# EAGLE design IO4-QuadOD (EAGLE 7.7.0)
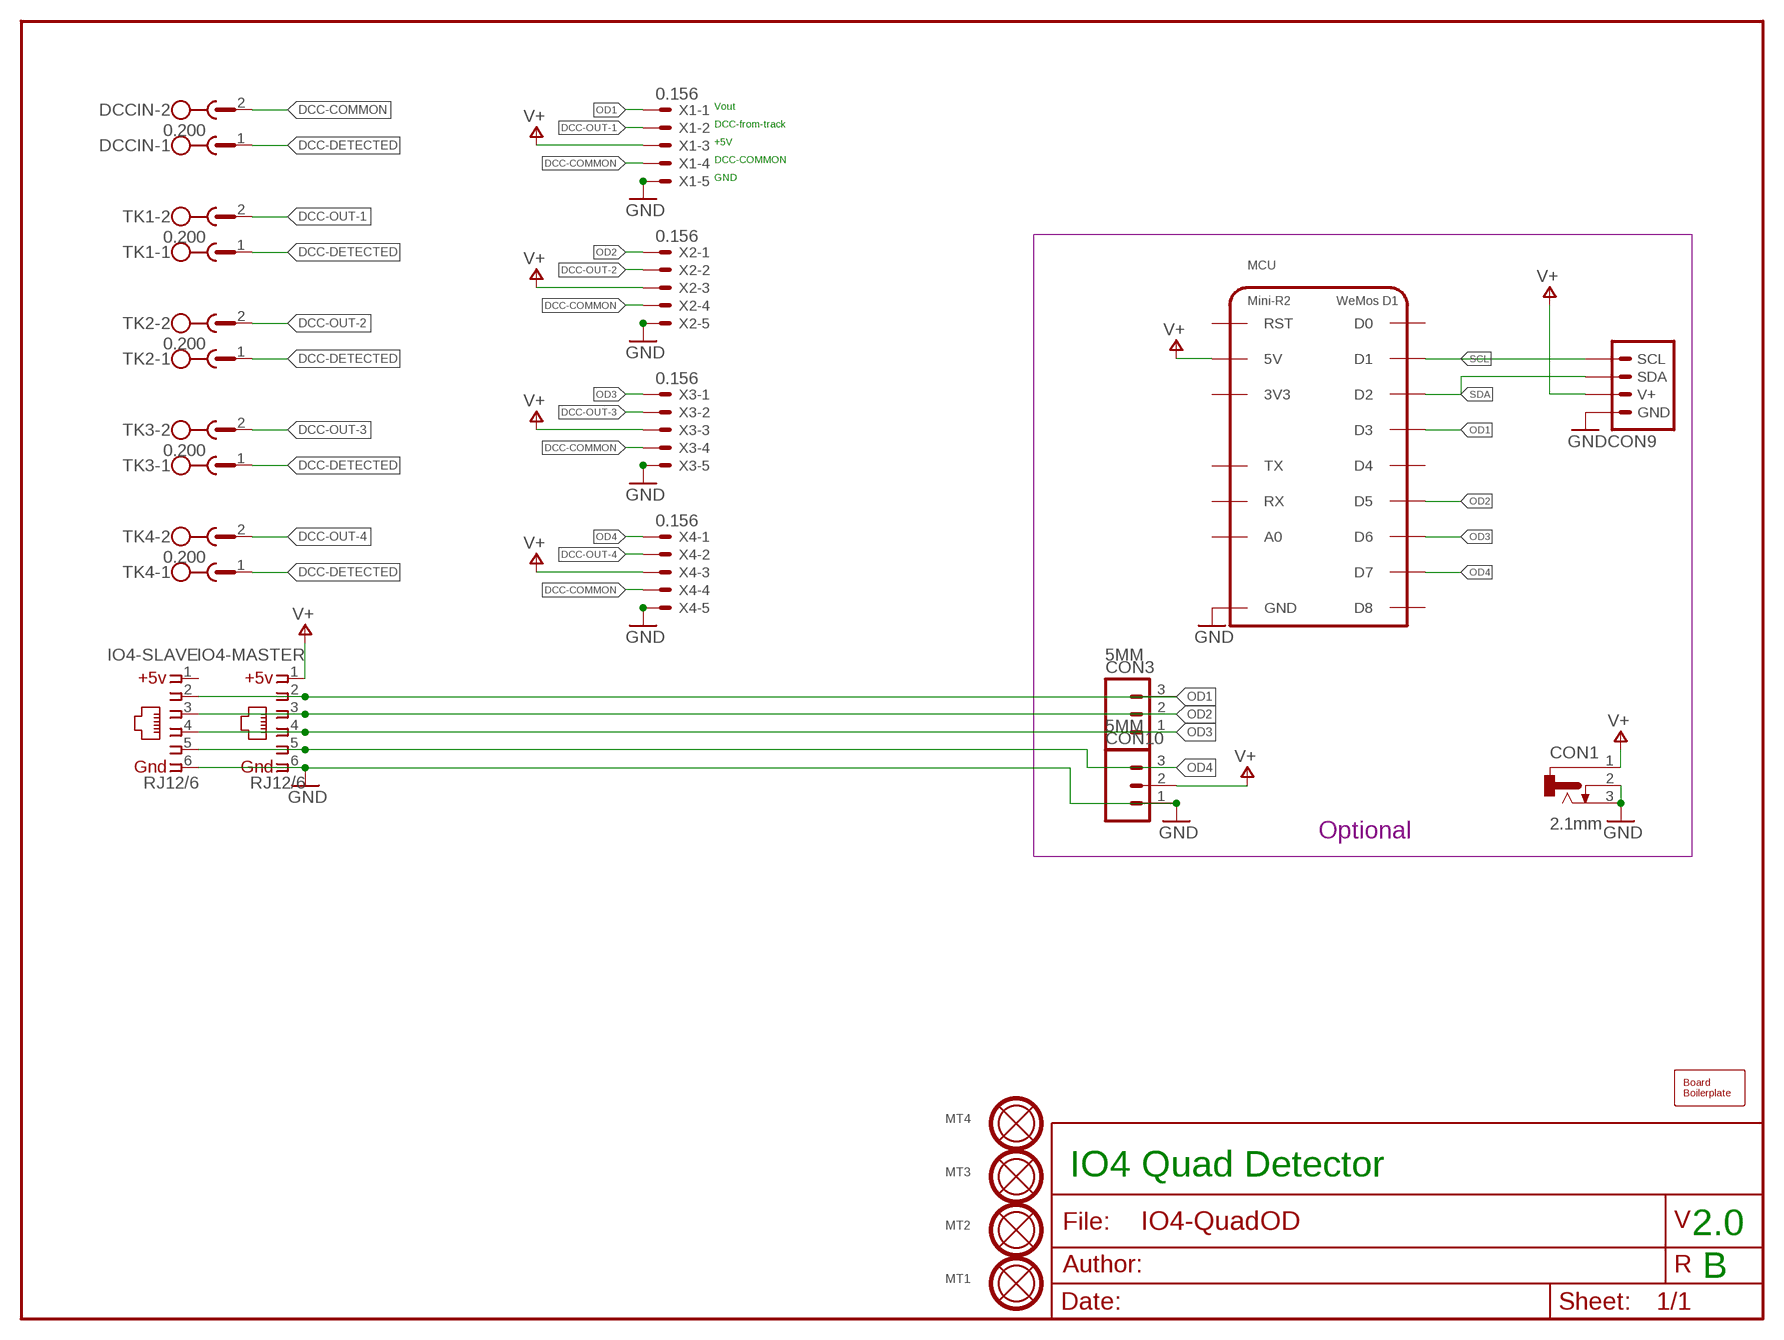
[diagram p0: schematic, sheet 1]

## Parts
BOARD1  BOARD  BOARD100X100-NOHOLES  [BOARD-SEEED10X10-NOHOLES]
CON1  2.1mm  CONNECTOR-DC-POWER-RA  [DCJ0202]
CON3  5MM  CONNECTOR-M035MM-LOCK  [SCREWTERMINAL-5MM-3]
CON9  CONNECTOR-I2CLEFT  [I2C-L]
CON10  5MM  CONNECTOR-M035MM-LOCK  [SCREWTERMINAL-5MM-3]
DCCIN  0.200  CONNECTOR-MSTBA2-ORIG  [MSTBA2]
IO4-MASTER  RJ12/6  CONNECTOR-IO4INV  [RJ25-INVERTED]
IO4-SLAVE  RJ12/6  CONNECTOR-IO4INV  [RJ25-INVERTED]
MCU  Mini-R2  WEMOS-D1V1  [WEMOS-D1]
MT1  MOUNTINGHOLE  [MOUNTINGHOLE]
MT2  MOUNTINGHOLE  [MOUNTINGHOLE]
MT3  MOUNTINGHOLE  [MOUNTINGHOLE]
MT4  MOUNTINGHOLE  [MOUNTINGHOLE]
TK1  0.200  CONNECTOR-MSTBA2-ORIG  [MSTBA2]
TK2  0.200  CONNECTOR-MSTBA2-ORIG  [MSTBA2]
TK3  0.200  CONNECTOR-MSTBA2-ORIG  [MSTBA2]
TK4  0.200  CONNECTOR-MSTBA2-ORIG  [MSTBA2]
X1  0.156  KK-156-5  [KK-156-5]
X2  0.156  KK-156-5  [KK-156-5]
X3  0.156  KK-156-5  [KK-156-5]
X4  0.156  KK-156-5  [KK-156-5]

## Nets
DCC-COMMON: DCCIN.2 X1.4 X2.4 X3.4 X4.4
DCC-DETECTED: DCCIN.1 TK1.1 TK2.1 TK3.1 TK4.1
DCC-OUT-1: TK1.2 X1.2
DCC-OUT-2: TK2.2 X2.2
DCC-OUT-3: TK3.2 X3.2
DCC-OUT-4: TK4.2 X4.2
GND: CON1.2 CON1.3 CON9.GND CON9.GND@1(GND) CON10.1 IO4-MASTER.6 IO4-SLAVE.6 MCU.GND X1.5 X2.5 X3.5 X4.5
OD1: CON3.3 IO4-MASTER.2 IO4-SLAVE.2 MCU.D3 X1.1
OD2: CON3.2 IO4-MASTER.3 IO4-SLAVE.3 MCU.D5 X2.1
OD3: CON3.1 IO4-MASTER.4 IO4-SLAVE.4 MCU.D6 X3.1
OD4: CON10.3 IO4-MASTER.5 IO4-SLAVE.5 MCU.D7 X4.1
SCL: CON9.SCL CON9.SCL@1(SCL) MCU.D1
SDA: CON9.SDA CON9.SDA@1(SDA) MCU.D2
V+: CON1.1 CON9.V+ CON9.V+@1(V+) CON10.2 IO4-MASTER.1 MCU.5V X1.3 X2.3 X3.3 X4.3
Unconnected: MCU.3V3 MCU.A0 MCU.D0 MCU.D4 MCU.D8 MCU.RST MCU.RX MCU.TX

## Notes on the sheet
- Vout
- DCC-from-track
- +5V
- DCC-COMMON
- GND
- Optional
- IO4 Quad Detector
- 2.0
- B

## Power pins joined to a net without a drawn wire
1: IO4-SLAVE.1

## Library data of the parts
BOARD1 = SPCoast:BOARD
CON1 = SPCoast:CONNECTOR-DC-POWER: DC POWER JACK
CON3 CON10 = SPCoast:CONNECTOR-M03
CON9 = SPCoast:CONNECTOR-I2C
DCCIN TK1-TK4 = SPCoast:CONNECTOR-MSTBA2-ORIG: PHOENIX; MF: FARNELL; MPN: 1757242; OC_FARNELL: 3705171; OC_NEWARK: 71C4161
IO4-MASTER IO4-SLAVE = SPCoast:CONNECTOR-IO4
MCU = SPCoast:WEMOS-D1
MT1-MT4 = SPCoast:MOUNTINGHOLE: Mounting hole with top and bottom copper and stop rings
X1-X4 = SPCoast:KK-156-5: KK 156 HEADER Source: http://www.molex.com/pdm_docs/sd/026604100_sd.pdf; OC_FARNELL: unknown; OC_NEWARK: unknown

## Board
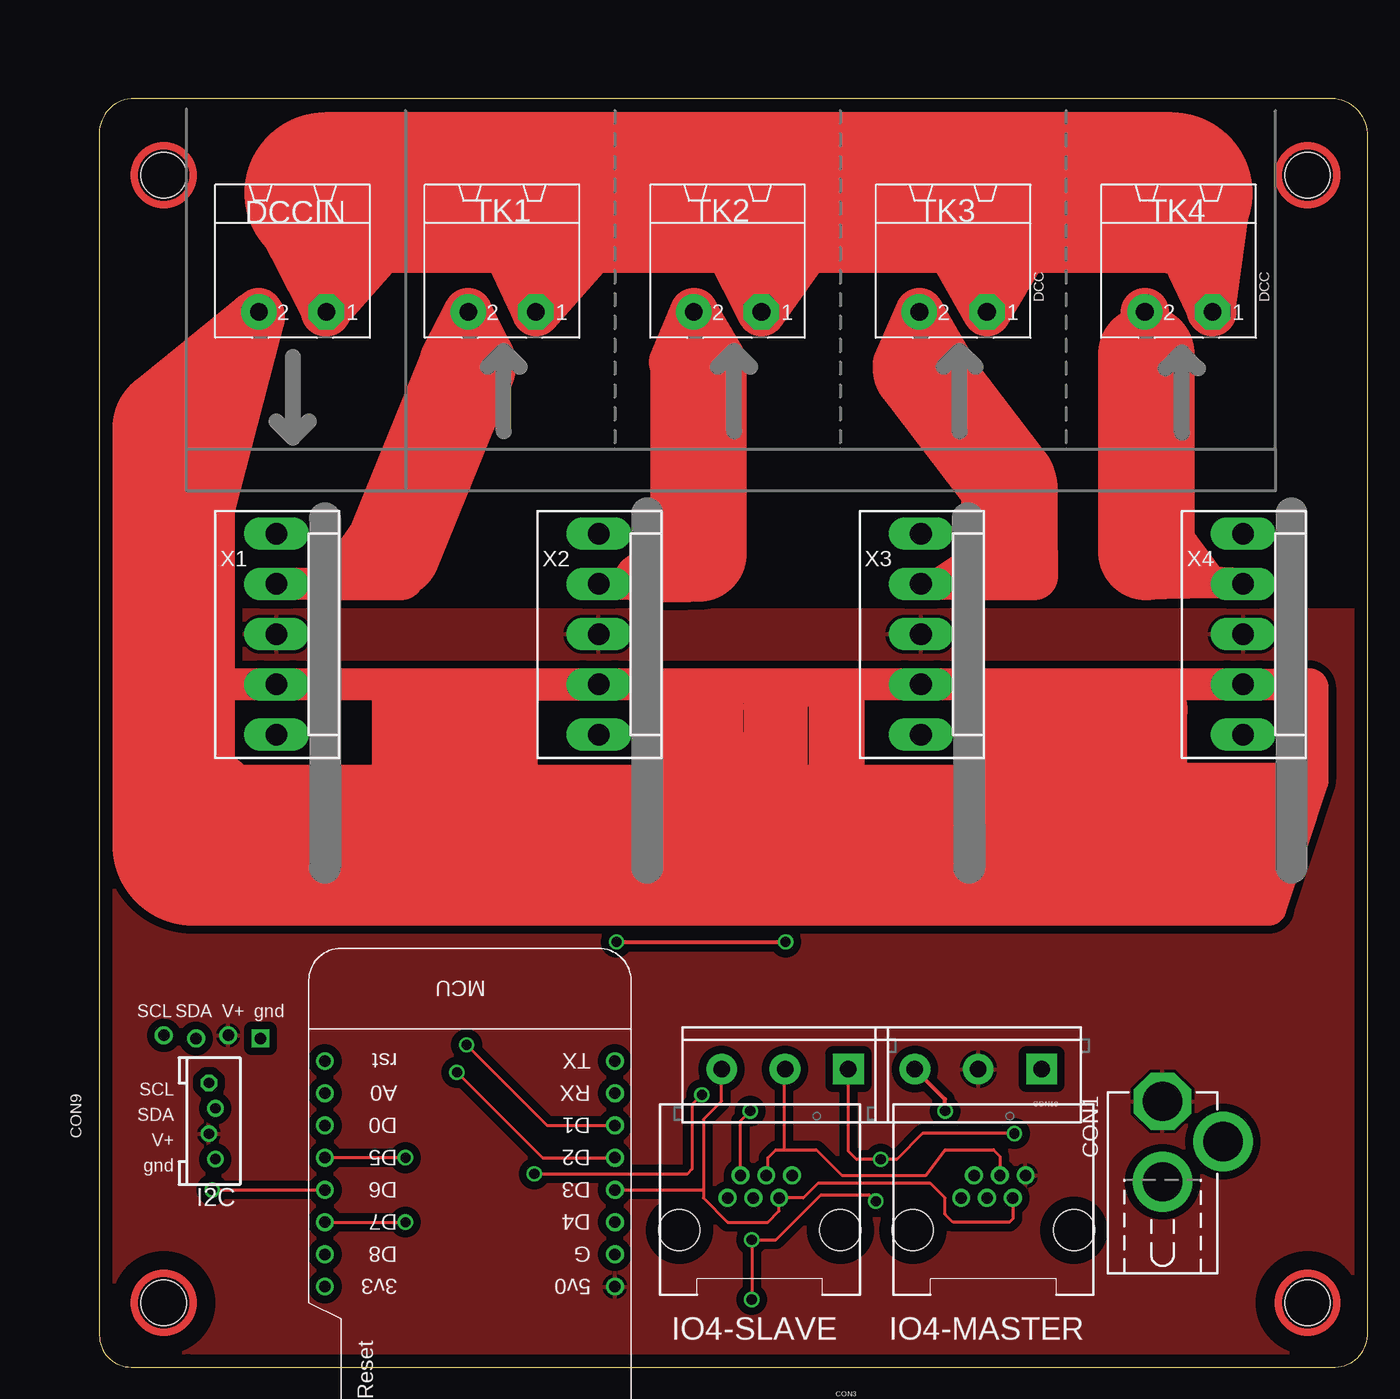
[diagram p1: board, top side]
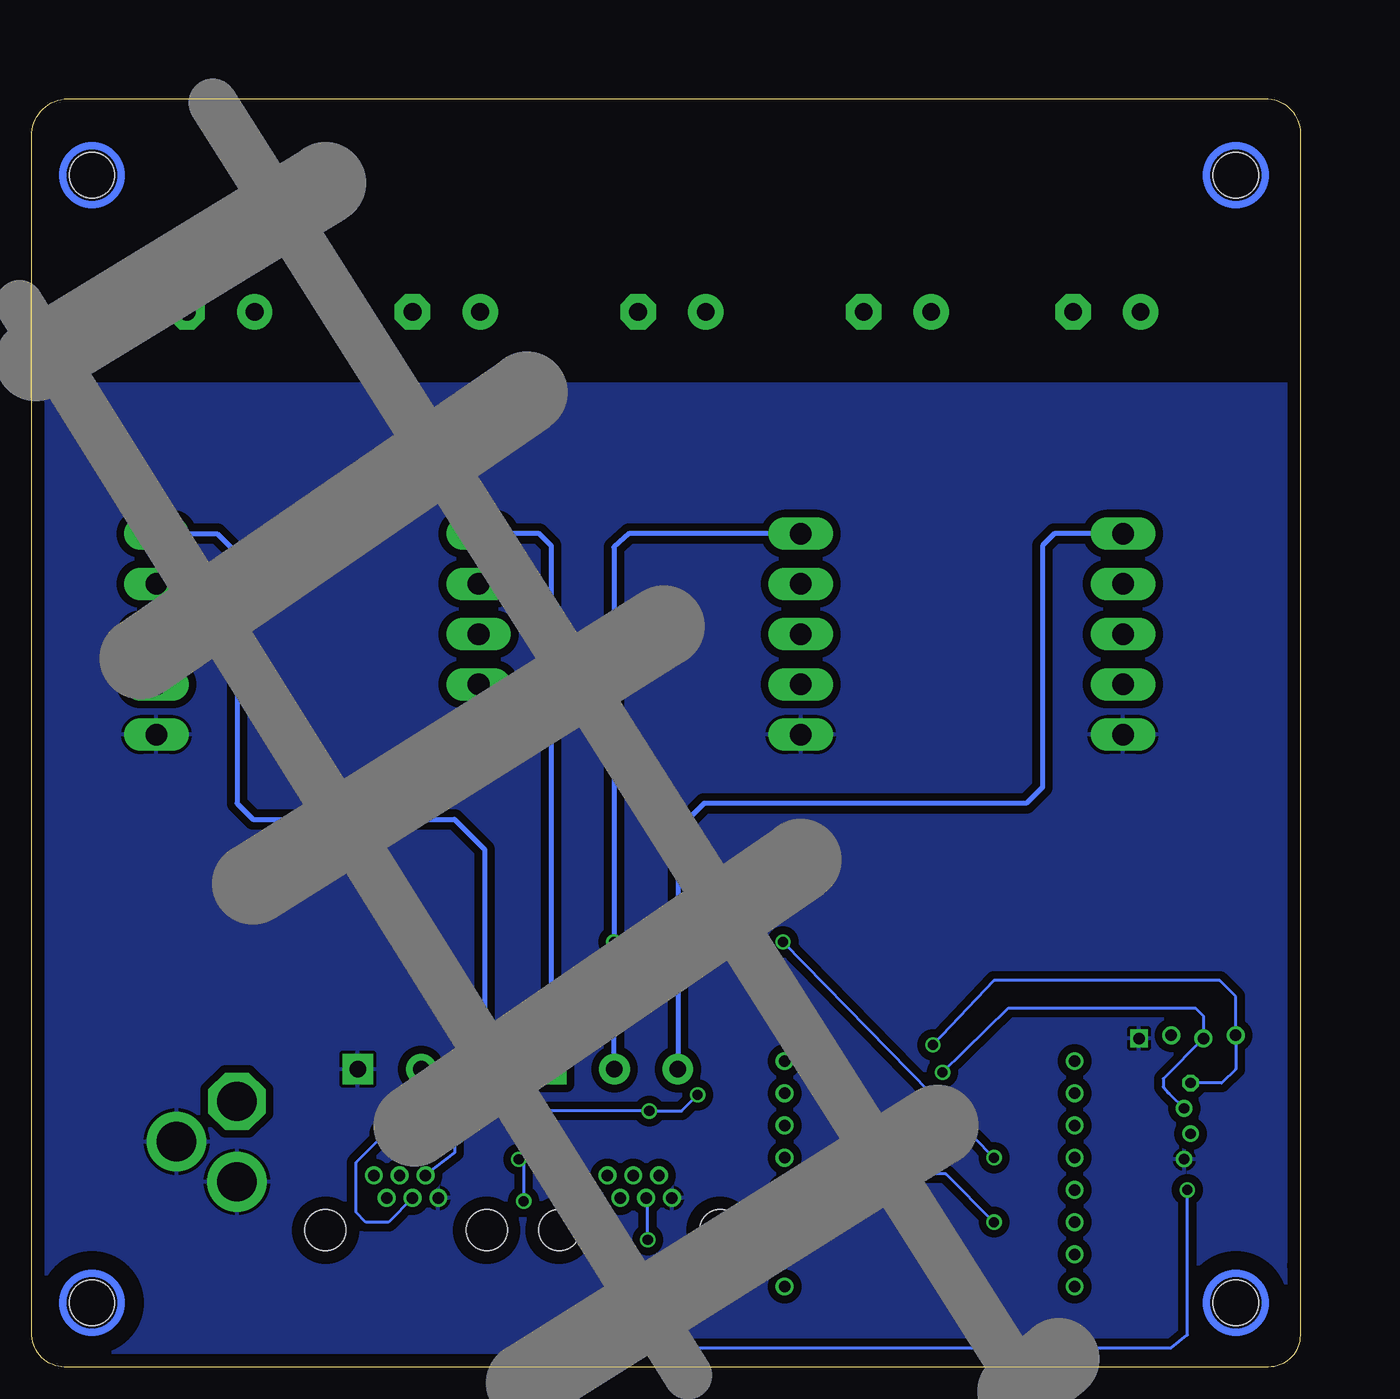
[diagram p2: board, bottom side, seen from below]

Size 100.01 x 100 mm. Coordinates in mm from the lower left corner, seen from the top.
Copper layers (1*16): Top 0.035mm / dielectric 1.5mm / Bottom 0.035mm
Design rules "default": minimum track width 10mil, minimum drill 24mil, track to track 8mil, track to pad 8mil, pad to pad 8mil, via to via 8mil, smd to smd 8mil, copper to edge 40mil, drill to drill 8mil, minimum pad ring 10mil, minimum via ring 8mil, stop-mask expansion 4mil, vias tented up to drill 0mil, thermal gap 10mil

### Footprints (pad centres in the part's own frame; a part is rotated, then mirrored left to right if it is on the bottom)
DCJ0202 = drill 3.1 pad 4.5 octagon: 1 0,3.175 | drill 3.1 pad 4.7: 2 4.763,0; 3 0,-3.175
SCREWTERMINAL-5MM-3 = drill 1.3 pad 2.413 square: 1 0,0 | drill 1.3 pad 2.413: 2 5,0; 3 10,0
I2C-L = drill 0.9 square: GND 3.81,-0.127 | drill 0.8 pad 1.27: GND@1 0.254,-9.635; SDA@1 0.254,-5.635; V+@1 -0.254,-7.635 | drill 0.9: SCL -3.81,0.127; SDA -1.27,-0.127; V+ 1.27,0.127 | drill 0.8 pad 1.27 octagon: SCL@1 -0.254,-3.635
MSTBA2 = drill 1.397 pad 2.794 octagon: 1 -2.667,5.08 | drill 1.397 pad 2.794: 2 2.667,5.08
RJ25-INVERTED = drill 0.9 pad 1.4: 1 2.54,4.318; 2 1.524,2.54; 3 0.508,4.318; 4 -0.508,2.54; 5 -1.524,4.318; 6 -2.54,2.54 | hole 3.251: -6.35,0; 6.35,0
WEMOS-D1 = drill 0.9: 3V3 -11.43,-7.62; 5V 11.43,-7.62; A0 -11.43,7.62; D0 -11.43,5.08; D1 11.43,5.08; D2 11.43,2.54; D3 11.43,0; D4 11.43,-2.54; D5 -11.43,2.54; D6 -11.43,0; D7 -11.43,-2.54; D8 -11.43,-5.08; GND 11.43,-5.08; RST -11.43,10.16; RX 11.43,7.62; TX 11.43,10.16
MOUNTINGHOLE = hole 3.6: 0,0
KK-156-5 = drill 1.7 pad 2.184 long: 1 -7.92,0; 2 -3.96,0; 3 0,0; 4 3.96,0; 5 7.92,0

### Placement (x,y rotation side)
BOARD1  0.01,0 0 top
CON1  83.83,17.78 0 top
CON3  59.06,23.5 180 top
CON9  8.9,26.04 0 top
CON10  74.3,23.5 180 top
DCCIN  15.25,88.27 180 top
IO4-MASTER  70.49,10.8 0 top
IO4-SLAVE  52.08,10.8 0 top
MCU  29.22,13.97 0 top
MT1  5.09,5.08 0 top
MT2  95.26,5.08 0 top
MT3  95.26,93.98 0 top
MT4  5.09,93.98 0 top
TK1  31.76,88.27 180 top
TK2  49.54,88.27 180 top
TK3  67.32,88.27 180 top
TK4  85.1,88.27 180 top
X1  13.98,57.79 270 top
X2  39.38,57.79 270 top
X3  64.78,57.79 270 top
X4  90.18,57.79 270 top

### Tracks (layer width: path | path; a pad name or v marks a point on that pad's centre or on a via)
DCC-COMMON
  Top 10.16: 7.5,43.31 6.74,42.68
  Top 11.43: 7.38,41.15 7.5,43.31
  Top 12.7: 81.29,41.15 7.38,41.15
  Top 2.54: 6.08,54.34 6.74,42.68 | 59.06,53.47 59.06,43.82 57.29,43.82 | 57.29,43.82 52.08,43.82 52.08,46.99 | 52.08,46.99 52.08,53.6 44.33,53.6 44.33,46.36 54.62,46.36 54.62,53.34 57.16,53.34 57.16,46.36 | 28.33,53.34 30.87,53.34 30.87,45.6 33.28,45.6 33.28,53.83 X2.4 | 28.33,45.98 25.28,45.98 | 25.28,52.96 22.74,53.72 22.74,43.69 | 95.39,53.57 95.39,53.85 93.99,53.85 X4.4 X3.4 X2.4 | 95.39,46.36 85.1,46.36 85.1,44.45 | 85.1,44.45 94.75,44.58 94.24,42.29 85.73,42.55 85.73,40.64 93.35,40.64 92.97,38.74 82.56,38.74 81.29,36.2 | X2.4 X1.4 9.38,53.83 8.9,53.34 | 57.29,43.69 57.29,43.82 | 82.56,43.31 83.32,44.45 85.1,44.45 | 72.4,49.53 69.86,52.07 | 69.86,52.07 69.86,53.34 | 69.86,52.07 69.86,46.99 | 52.08,46.99 49.54,49.53 49.54,52.07 47,52.07 arc60 49.54,46.99 47,46.99 45.73,48.26 45.73,52.07
  Top 2.794: 81.29,36.2 92.21,36.2 95.51,46.23
  Top 3.048: 28.33,53.34 28.33,45.98 | 25.28,45.98 25.28,52.96 | 95.39,53.57 95.39,46.36
  Top 3.81: DCCIN.2 12.07,82.68 9.28,76.71 12.07,82.81 4.07,76.33 8.77,67.57 12.71,82.68 12.71,82.93 6.74,73.66
  Top 6.452: 81.29,41.15 82.56,43.31 82.56,51.82 78.37,51.69 78.11,51.69 78.11,46.28 78.11,43.31 78.37,43.69 57.29,43.69
  Top 7.62: 78.11,46.28 74.86,49.53 72.4,49.53
  Top 9.652: 6.74,42.68 5.85,41.15 5.85,74.04 6.74,74.04 6.74,73.66
DCC-DETECTED
  Top 12.7: 84.59,92.59 73.67,92.59 53.98,92.59 35.57,92.59 17.79,92.59
  Top 3.81: DCCIN.1 13.98,90.81 22.87,88.9 17.79,83.19 17.79,92.59 17.92,93.98 | 84.59,92.59 88.91,92.46 87.64,83.32 TK4.1 85.35,88.27 | 73.67,92.59 69.99,92.84 73.16,88.52 TK3.1 66.18,89.92 | 53.98,92.59 52.21,92.84 56.02,88.52 TK2.1 48.14,91.19 | 35.57,92.59 34.43,92.84 38.62,87.89 TK1.1 29.85,92.97
DCC-OUT-1
  Top 2.54: X1.2 20.2,61.73 18.55,62.36 20.96,65.79
  Top 3.81: 23.12,64.39 23.76,62.36 18.55,62.36 | 29.09,79 27.19,79.51 TK1.2 30.87,79.63
  Top 7.62: 23.12,64.39 29.09,79
DCC-OUT-2
  Top 2.54: 42.55,62.23 42.4,61.75 X2.2 | 44.46,63.5 44.52,63.44 46.43,63.44
  Top 3.81: 44.46,63.5 44.59,62.23 | 47.25,64.14 46.43,63.44 46.36,63.38 46.36,62.23 43.19,62.23 | 44.46,63.5 42.55,62.23 43.19,62.23 | 44.46,63.5 45.09,64.14 45.73,64.14 43.19,62.23 | 47.25,78.36 45.22,79.25 | 45.22,79.25 TK2.2 49.29,79.12 45.22,79.25
  Top 7.62: 47.25,64.14 47.25,78.36
DCC-OUT-3
  Top 2.54: 68.59,62.36 68.82,61.75 66.23,61.75 | 66.23,61.75 X3.2 | 66.23,61.75 69.99,64.27
  Top 3.81: 71.64,69.73 71.76,69.35 | 71.76,64.39 73.67,64.14 73.67,62.36 68.59,62.36 | 64.78,78.74 62.87,79.12 TK3.2 67.32,78.62
  Top 7.62: 71.76,69.35 71.76,64.39 | 71.64,69.73 64.78,78.74
DCC-OUT-4
  Top 2.54: X4.2 87.69,61.86 | 87.69,61.86 82.31,61.75 82.18,63.25 82.56,64.27 | 87.69,61.86 84.21,66.55
  Top 3.81: TK4.2 82.56,79.89
  Top 7.62: 82.56,79.89 82.56,64.27
GND
  pour Bottom (isolate 0.61): 100.34,77.47 100.34,0 0.01,0 0.01,77.47
OD1
  Top 0.254: IO4-MASTER.2 72.02,11.69 71.76,11.43 67.32,11.43 66.68,12.07 66.68,13.34 65.54,14.48 56.65,14.48 55.51,13.34 IO4-SLAVE.2 53.6,12.32 52.71,11.43 49.54,11.43 47.63,13.34 47.63,13.97 | 47.63,13.97 47.63,19.53 49.06,20.96 CON3.3 | MCU.D3 47.63,13.97
  Bottom 0.406: X1.1 19.39,65.71 20.33,64.77 20.33,45.72 21.6,44.45 47,44.45 49.06,42.39 CON3.3
OD2  (via drill 0.8)
  Top 0.254: IO4-SLAVE.3 52.71,15.24 52.71,16.51 53.35,17.15 53.98,17.15 | 53.98,17.15 56.52,17.15 58.56,15.12 65.16,15.12 66.68,17.15 70.49,17.15 71,16.64 IO4-MASTER.3 | v24.14,16.51 MCU.D5 | CON3.2 53.98,23.42 53.98,17.15
  Top 0.305: v40.78,33.53 v54.11,33.53
  Bottom 0.254: v40.78,33.53 v24.14,16.51
  Bottom 0.406: X2.1 52.92,65.71 54.11,64.65 v54.11,33.53 54.11,25.96 CON3.2
OD3  (via drill 0.8)
  Top 0.254: v72.15,18.42 64.91,18.42 62.87,16.39 v61.6,16.39 59.7,16.39 59.06,17.02 CON3.1 | v51.44,5.34 v51.44,10.04 53.35,10.04 56.91,13.59 60.72,13.59 v61.22,13.08 | v8.9,13.97 MCU.D6
  Bottom 0.254: 51.44,13.34 IO4-SLAVE.4 51.44,13.21 v51.44,10.04 | IO4-MASTER.4 71.89,11.43 73.67,11.43 74.43,12.2 74.43,16.13 v72.15,18.42 | v61.6,16.39 61.22,16.01 v61.22,13.08 | v51.44,5.34 48.9,1.53 10.17,1.53 8.9,2.54 v8.9,13.97
  Bottom 0.406: CON3.1 59.06,64.77 60,65.71 X3.1
OD4  (via drill 0.8)
  Top 0.254: IO4-SLAVE.5 50.56,19.43 v51.32,20.2 | MCU.D7 v24.14,11.43 | v34.3,15.24 46.36,15.24 46.75,15.62 46.75,20.7 v47.51,21.47
  Top 0.305: v66.68,20.2 66.68,21.12 CON10.3
  Bottom 0.254: IO4-MASTER.5 68.84,15.24 66.68,16.89 v66.68,20.2 | 50.43,15.24 IO4-SLAVE.5 | v24.14,11.43 27.95,15.24 v34.3,15.24 | v47.51,21.47 48.78,20.2 v51.32,20.2 61,20.2 CON10.3 64.14,23.34
  Bottom 0.406: X4.1 85.4,65.71 83.83,64.14 83.83,44.45 82.56,43.18 66.68,43.18 64.3,40.8 CON10.3
SCL  (via drill 0.8)
  Top 0.254: v28.97,25.4 35.32,19.05 MCU.D1
  Bottom 0.254: CON9.SCL@1 6.18,22.4 5.09,23.5 CON9.SCL 5.09,29.21 6.36,30.48 24.14,30.48 v28.97,25.4
SDA  (via drill 0.8)
  Top 0.254: v28.2,23.24 34.93,16.51 MCU.D2
  Bottom 0.254: CON9.SDA@1 10.34,21.59 10.8,22.1 10.8,22.74 CON9.SDA 7.63,27.69 8.26,28.32 23,28.32 v28.2,23.24
V+
  pour Top (isolate 0.61): 100.21,59.69 100.34,0 0.01,0 -0.12,59.69

### Text on the board
tNames: DCC | DCC
tDocu: V2.0B | DCC IN | Block 1 | Block 2 | Block 3 | Block 4 | John Plocher | 2018-11 | Det / / Com | Det / / Com | Det / / Com | Det / / Com | Det / / Com | DCC Booster | Track Blocks | IO4-QuadOD | Detect | TRACK | V+ | COMMON | GND | GND | GND | GND | CP-OD / -or- / DCCOD | 1 | 2 | 3 | 4 | 5V I2C | 1 2 3 4 +5v GND | 5 VDC | Wemos / D1 Mini
bDocu: IO4-QuadOD | Made in the PCR, Coast Division, NMRA | Go Bears! | Quad OD detector baseboard / / (Inspired by railnerd, MFS, / MRCS, RR-Cirkits and, / of course, / Dr Bruce Chubb) | Model Railroading is Fun! | Build Options: / / 1) IO4 peripheral / 2) wallwart powered / with screw terminals / 3) Wemos D1mini / with I2C and WiFi | www. SPCoast .com